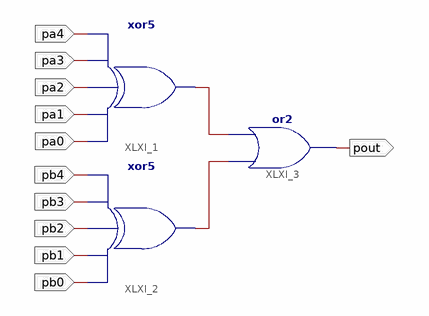
[diagram p0: schematic sheet 1]
// Xilinx ISE schematic parity_check.sch (xc9500xl) as structural Verilog: 3 symbols, 11 ports
module parity_check (
  input  pa4,
  input  pa3,
  input  pa2,
  input  pa1,
  input  pa0,
  input  pb4,
  input  pb3,
  input  pb2,
  input  pb1,
  input  pb0,
  output pout
);

  wire XLXN_1, XLXN_2;

  xor XLXI_1 (XLXN_1, pa0, pa1, pa2, pa3, pa4);
  xor XLXI_2 (XLXN_2, pb0, pb1, pb2, pb3, pb4);
  or XLXI_3 (pout, XLXN_2, XLXN_1);
endmodule
